# Altium schematic sheet H16R7x_Frontend 1.SchDoc
size Letter; CompanyName: Hexabitz; DocumentNumber: 2; SheetNumber: 2; SheetTotal: 3; Module_Name: H16R7x; Module_Description: IPS Display Module
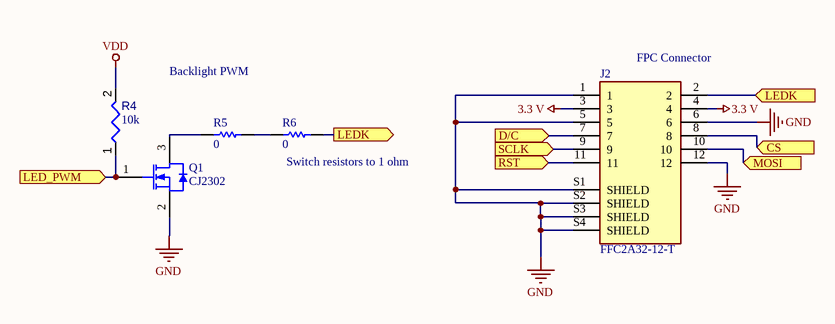
[diagram p0: H16R7x_Frontend 1.SchDoc]

## Parts
J2  FFC2A32-12-T  [GCT_FFC2A32-12-T]
Q1  CJ2302  [JSCJ-SOT23-3_V]
R4  value 10k  [RESC0402(1005)_L]  (hidden comment: 10KR2F)
R5  value 0  [RESC2013X50X35ML15T15]  (hidden comment: Resistor 0R +/- 1% 0805 125 mW)
R6  value 0  [RESC2013X50X35ML15T15]  (hidden comment: Resistor 0R +/- 1% 0805 125 mW)

## Ports
CS (in), D/C (in), LED_PWM (in), LEDK (in), LEDK (out), MOSI (in), RST (in), SCLK (in)

## Nets
3.3 V: J2.3 J2.4
GND: J2.1 J2.5 J2.6 J2.12 J2.S1(SHIELD) J2.S2(SHIELD) J2.S3(SHIELD) J2.S4(SHIELD) Q1.2(S)
VDD: R4.2
CS: J2.8 ; port CS
D/C: J2.7 ; port D/C
LED_PWM: Q1.1(G) R4.1 ; port LED_PWM
LEDK: J2.2 R6.2 ; port LEDK
MOSI: J2.10 ; port MOSI
RST: J2.11 ; port RST
SCLK: J2.9 ; port SCLK
NetQ1_3: Q1.3(D) R5.1
NetR5_2: R5.2 R6.1

## Notes on the sheet
- (near J2) FPC Connector
- Backlight PWM
- (near R6) Switch resistors to 1 ohm
- Module:
- Title:
- Description:
- Size:
- Revision:
- Letter
- www.hexabitz.com
- Date:
- Time:
- Sheet
- of

## Library data of the parts
J2 = CMP-002-00071-1: 12 Position FFC, FPC Connector Contacts, Vertical - 1 Sided 0.020 (0.50mm) Surface Mount; MF: Global Connector Technology; SnapEDA_Link: https://www.snapeda.com/parts/FFC2A32-12-T/Global+Connector+Technology/view-part/?ref=snap; Value: *; Design Item ID: FFC2A32-12-T; MP: FFC2A32-12-T; Source: FFC2A32-12-T.SchLib; Pins: 16; Component Type: Standard; Case/Package: None; Check_prices: https://www.snapeda.com/parts/FFC2A32-12-T/Global+Connector+Technology/view-part/?ref=eda
Q1 = CMP-013-00014-3: N-Channe Plastic Encapsulate MOSFET, 20 V, 2.1 A, 3-Pin SOT23, Tape and Reel; Manufacturer: Jiangsu Changjiang Electronics Technology; Package Version: Rev. E, 09/2009; Package Reference: SOT23-3; Mounting Technology: SM; Datasheet Version: Rev. D, 08/2015; RoHS Compliant: Unknown; Package Description: 3-Pin Small Outline Transistor, Body 2.9 x 1.3 mm, Pitch 0.95 mm; Datasheet URL: http://www.cj-elec.com/gallery/txUpfile/9c19fa03e8d43801a6647d386a41a240.pdf; Case/Package: SOT23-3
R4 = CMP-009-00066-2: 10K 0.063W 1% 0402 (1005 Metric)  SMD; Power: 63mW; Case/Package: 0402; Mounting Technology: SMT; Pins: 2; Tolerance: 1%
R5 R6 = CMP-009-00001-5: Chip Resistor, 0 Ohm, +/- 1%, 125 mW, -55 to 155 degC, 0805 (2012 Metric); Voltage Rating: 150V; Power: 125mW; Mounting Technology: SM; Max Operating Temperature: 155°C; Case/Package: 0805; RoHS Compliant: True; Pins: 2; Min Operating Temperature: -55°C; Tolerance: 1%